# Altium schematic sheet Non-Isolated Gate Driver and Supply.SchDoc
size A4
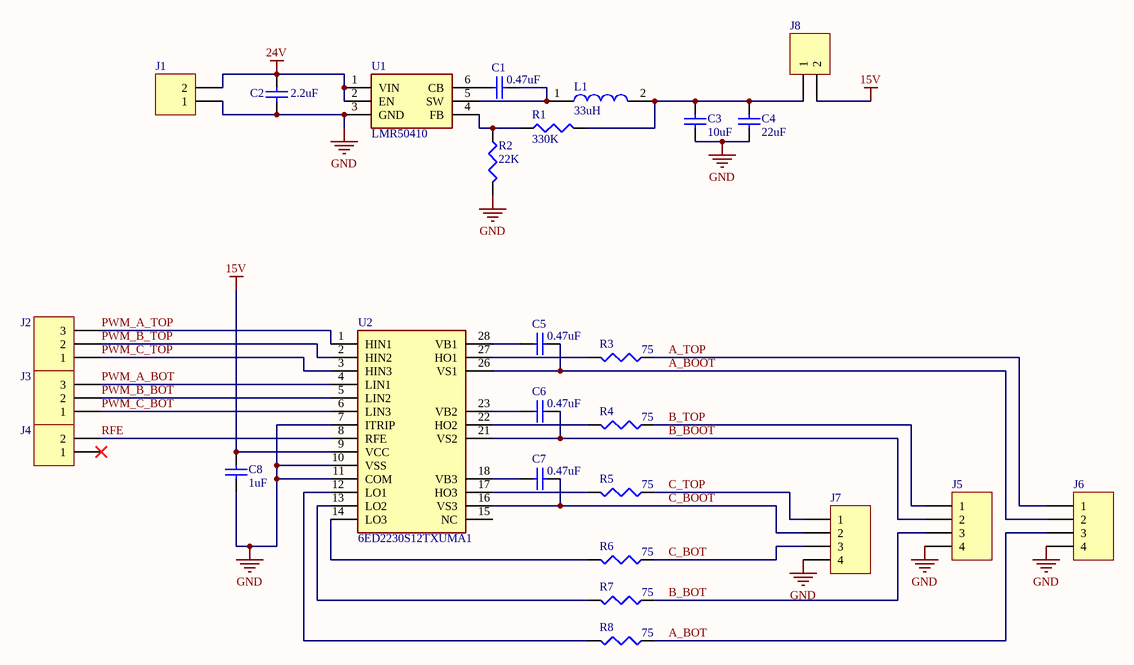
[diagram p0: Non-Isolated Gate Driver and Supply.SchDoc]

## Parts
C1  value 0.47uF  [C0805]  (hidden comment: Cap)
C2  value 2.2uF  [C0805]  (hidden comment: Cap)
C3  value 10uF  [C0805]  (hidden comment: Cap)
C4  value 22uF  [C0805]  (hidden comment: Cap)
C5  value 0.47uF  [C1206]  (hidden comment: Cap)
C6  value 0.47uF  [C1206]  (hidden comment: Cap)
C7  value 0.47uF  [C1206]  (hidden comment: Cap)
C8  value 1uF  [C0805]  (hidden comment: Cap)
J1  Header 2  [HDR1X2]  (value not drawn)
J2  Header 3  [HDR1X3]  (value not drawn)
J3  Header 3  [HDR1X3]  (value not drawn)
J4  Header 2  [HDR1X2]  (value not drawn)
J5  Header 4  [HDR1X4]  (value not drawn)
J6  Header 4  [HDR1X4]  (value not drawn)
J7  Header 4  [HDR1X4]  (value not drawn)
J8  Header 2  [HDR1X2]  (value not drawn)
L1  33uH  [PM4340682NLT]
R1  value 330K  [J1-0603]  (hidden comment: Res3)
R2  value 22K  [J1-0603]  (hidden comment: Res3)
R3  value 75  [C1206]  (hidden comment: Res3)
R4  value 75  [C1206]  (hidden comment: Res3)
R5  value 75  [C1206]  (hidden comment: Res3)
R6  value 75  [C1206]  (hidden comment: Res3)
R7  value 75  [C1206]  (hidden comment: Res3)
R8  value 75  [C1206]  (hidden comment: Res3)
U1  LMR50410  [SOT95P280X145-6N]
U2  6ED2230S12TXUMA1  [SOIC127P1030X265-28N]

## Nets
15V: C8.1 J8.2 U2.9(VCC)
24V: C2.1 J1.2 U1.1(VIN) U1.2(EN)
GND: C2.2 C3.2 C4.2 C8.2 J1.1 J5.4 J6.4 J7.4 R2.2 U1.3(GND) U2.7(ITRIP) U2.10(VSS) U2.11(COM)
A_BOOT: C5.1 J6.2 U2.26(VS1)
A_BOT: J6.3 R8.1
A_TOP: J6.1 R3.1
B_BOOT: C6.1 J5.2 U2.21(VS2)
B_BOT: J5.3 R7.1
B_TOP: J5.1 R4.1
C_BOOT: C7.1 J7.2 U2.16(VS3)
C_BOT: J7.3 R6.1
C_TOP: J7.1 R5.1
PWM_A_BOT: J3.3 U2.4(LIN1)
PWM_A_TOP: J2.3 U2.1(HIN1)
PWM_B_BOT: J3.2 U2.5(LIN2)
PWM_B_TOP: J2.2 U2.2(HIN2)
PWM_C_BOT: J3.1 U2.6(LIN3)
PWM_C_TOP: J2.1 U2.3(HIN3)
RFE: J4.2 U2.8(RFE)
NetC1_1: C1.1 U1.6(CB)
NetC1_2: C1.2 L1.1 U1.5(SW)
NetC3_1: C3.1 C4.1 J8.1 L1.2 R1.2
NetC5_2: C5.2 U2.28(VB1)
NetC6_2: C6.2 U2.23(VB2)
NetC7_2: C7.2 U2.18(VB3)
NetR1_1: R1.1 R2.1 U1.4(FB)
NetR3_2: R3.2 U2.27(HO1)
NetR4_2: R4.2 U2.22(HO2)
NetR5_2: R5.2 U2.17(HO3)
NetR6_2: R6.2 U2.14(LO3)
NetR7_2: R7.2 U2.13(LO2)
NetR8_2: R8.2 U2.12(LO1)

Not connected (* = marked no-connect by the designer): J4 1*; U2 15(NC)

## Library data of the parts
C1-C8 = Cap: Capacitor; Published: 8-Jun-2000; LatestRevisionDate: 17-Jul-2002; LatestRevisionNote: Re-released for DXP Platform.; PackageReference: RAD-0.3; Publisher: Altium Limited; PackageDescription: Radial Cap, Thru-Hole; 2 Leads; 0.3 in Pin Spacing
J1 J4 J8 = Header 2: Header, 2-Pin; LatestRevisionDate: 17-Jul-2002; LatestRevisionNote: Re-released for DXP Platform.; Publisher: Altium Limited
J2 J3 = Header 3: Header, 3-Pin; LatestRevisionDate: 17-Jul-2002; LatestRevisionNote: Re-released for DXP Platform.; Publisher: Altium Limited
J5-J7 = Header 4: Header, 4-Pin; LatestRevisionDate: 17-Jul-2002; LatestRevisionNote: Re-released for DXP Platform.; Publisher: Altium Limited
L1 = PM4340.333NLT: Inductor; Manufacturer_Name: Pulse; Datasheet Link: https://products.pulseelex.com/files/product_files/P767.pdf; Height: 2mm; Manufacturer_Part_Number: PM4340.333NLT; Arrow Part Number: PM4340.333NLT
R1-R8 = Res3: Resistor; Published: 8-Jun-2000; LatestRevisionDate: 29-May-2009; LatestRevisionNote: IPC-7351 Footprint Added.; PackageReference: J1-0603; Publisher: Altium Limited; PackageDescription: Chip Resistor
U1 = LMR50410: Integrated Circuit; Manufacturer_Name: Texas Instruments; Datasheet Link: https://www.ti.com/lit/ds/symlink/lmr50410.pdf?ts=1598511476132&ref_url=https%253A%252F%252Fwww.ti.com%252Fproduct%252FLMR50410; Height: 1.45mm; Manufacturer_Part_Number: LMR50410; Arrow Part Number: LMR50410
U2 = 6ED2230S12TXUMA1: Integrated Circuit; Manufacturer_Name: Infineon; Datasheet Link: https://www.arrow.com/en/products/6ed2230s12txuma1/infineon-technologies-ag; Height: 2.65mm; Manufacturer_Part_Number: 6ED2230S12TXUMA1; Arrow Part Number: 6ED2230S12TXUMA1; Arrow Price/Stock: https://www.arrow.com/en/products/6ed2230s12txuma1/infineon-technologies-ag; Mouser Part Number: 726-6ED2230S12TXUMA1; Mouser Price/Stock: https://www.mouser.co.uk/ProductDetail/Infineon-Technologies/6ED2230S12TXUMA1?qs=%252BEew9%252B0nqrDqONJq1%252BaRWQ%3D%3D